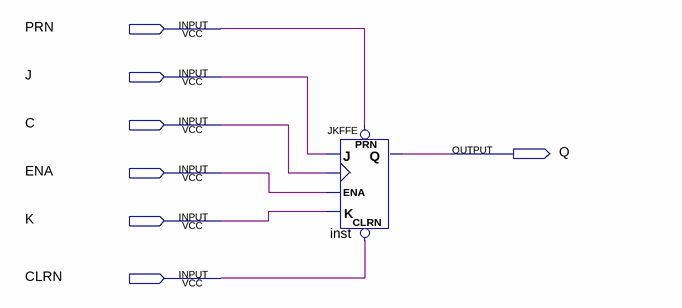
[diagram p0: schematic sheet]
// Quartus schematic lab_5_5.bdf as structural Verilog: 1 symbols, 7 pins
module lab_5_5 (
  input  PRN,
  input  J,
  input  C,
  input  ENA,
  input  K,
  input  CLRN,
  output Q
);

  JKFFE inst (.PRN(PRN), .J(J), .CLK(C), .CLRN(CLRN), .K(K), .ENA(ENA), .Q(Q));
endmodule
